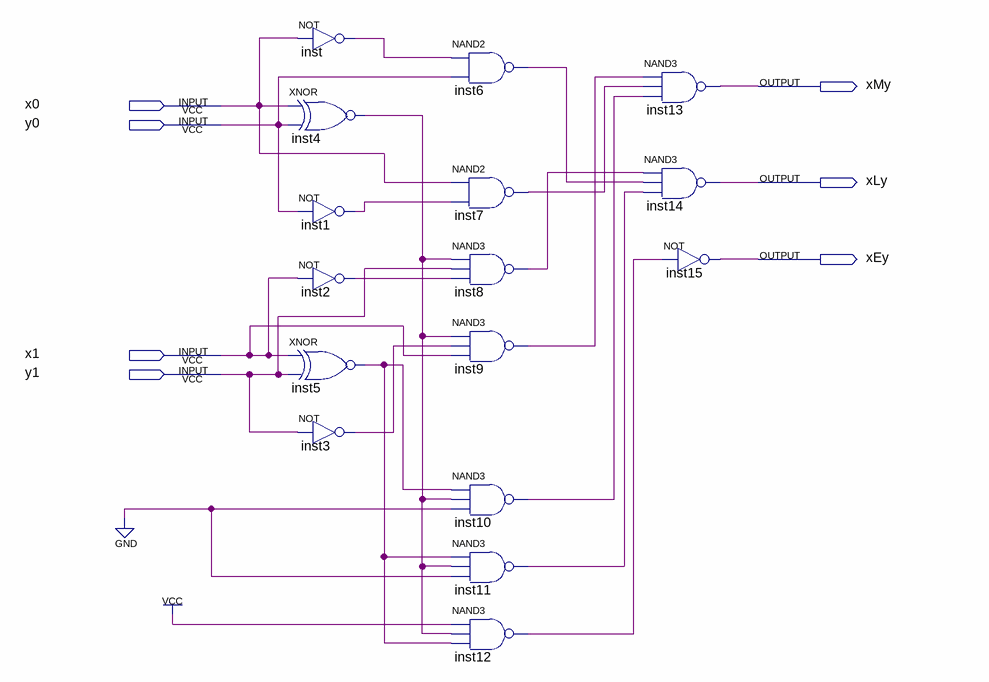
[diagram p0: schematic sheet]
// Quartus schematic comparat.bdf as structural Verilog: 16 symbols, 7 pins
module comparat (
  input  x0,
  input  y0,
  input  x1,
  input  y1,
  output xMy,
  output xLy,
  output xEy
);

  wire inst1_out, inst2_out, inst3_out, inst4_out, inst5_out, inst6_out, inst7_out, inst8_out, inst9_out,
       inst10_out, inst11_out, inst12_out, inst_out;

  not inst (inst_out, x0);
  xnor inst4 (inst4_out, x0, y0);
  not inst1 (inst1_out, y0);
  not inst2 (inst2_out, x1);
  xnor inst5 (inst5_out, x1, y1);
  not inst3 (inst3_out, y1);
  nand inst6 (inst6_out, inst_out, y0);
  nand inst7 (inst7_out, x0, inst1_out);
  nand inst8 (inst8_out, inst4_out, y1, inst2_out);
  nand inst9 (inst9_out, inst4_out, inst3_out, x1);
  nand inst10 (inst10_out, inst5_out, inst4_out, 1'b0);
  nand inst11 (inst11_out, inst5_out, inst4_out, 1'b0);
  nand inst12 (inst12_out, 1'b1, inst4_out, inst5_out);
  nand inst13 (xMy, inst9_out, inst7_out, inst10_out);
  nand inst14 (xLy, inst8_out, inst6_out, inst11_out);
  not inst15 (xEy, inst12_out);
endmodule
